# Altium schematic sheet IMU_breakout.SchDoc
size B
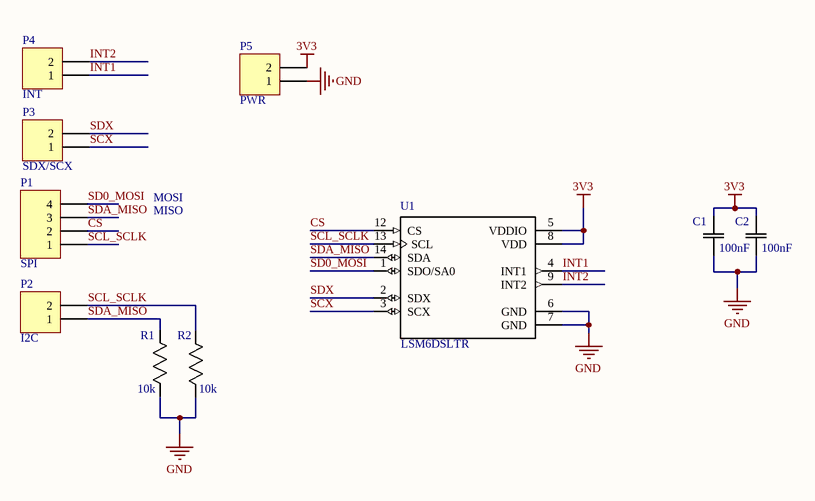
[diagram p0: IMU_breakout.SchDoc]

## Parts
C1  100nF  [0805]
C2  100nF  [0805]
P1  SPI  [HDR1X4]
P2  I2C  [HDR1X2]
P3  SDX/SCX  [HDR1X2]
P4  INT  [HDR1X2]
P5  PWR  [HDR1X2]
R1  10k  [0805]
R2  10k  [0805]
U1  LSM6DSLTR  [LGA-14]

## Nets
3V3: C1.2(C2) C2.2(C2) P5.2 U1.5(VDDIO) U1.8(VDD)
GND: C1.1(C1) C2.1(C1) P5.1 R1.2(R2) R2.2(R2) U1.6(GND) U1.7(GND)
CS: P1.2 U1.12(CS)
INT1: P4.1 U1.4(INT1)
INT2: P4.2 U1.9(INT2)
SCL_SCLK: P1.1 P2.2 R2.1(R1) U1.13(SCL)
SCX: P3.1 U1.3(SCX)
SD0_MOSI: P1.4 U1.1(SDO/SA0)
SDA_MISO: P1.3 P2.1 R1.1(R1) U1.14(SDA)
SDX: P3.2 U1.2(SDX)

## Notes on the sheet
- MOSI
- MISO

## Library data of the parts
C1 C2 = CAP 100nF 0805: CAP CER 0.1UF 50V X7R 0805; MP: CC0805KRX7R9BB104; MF: Yageo; Tolerance: 10%; Package: 0805; Price: 0,119 CAD; Value: 100nF; Digikey: 311-1140-1-ND; Digikey Link: https://www.digikey.ca/products/en?keywords=311-1140-1-ND; Rating: 50V
P1 = Header 4: Header, 4-Pin; LatestRevisionDate: 17-Jul-2002; LatestRevisionNote: Re-released for DXP Platform.; Publisher: Altium Limited
P2-P5 = Header 2: Header, 2-Pin; LatestRevisionDate: 17-Jul-2002; LatestRevisionNote: Re-released for DXP Platform.; Publisher: Altium Limited
R1 R2 = RES 10k 0805: RES SMD 10K OHM 1% 1/8W 0805; MP: RC0805FR-0710KL; MF: Yageo; Rating: 0.125W; Digikey: 311-10.0KCRCT-ND; Price: 0.061 CAD; Package: 0805; Value: 10k; Digikey Link: https://www.digikey.ca/products/en?keywords=311-10.0KCRCT-ND; Tolerance: 1%
U1 = LSM6DSLTR: Accelerometer, Gyroscope, Temperature, 6 Axis Sensor IÂ²C, SPI Output; MF: STMicroelectronics; SnapEDA_Link: https://www.snapeda.com/parts/LSM6DSLTR/STMicroelectronics/view-part/550517/?ref=snap; Price: None; Availability: Unavailable; MP: LSM6DSLTR; Package: LGA-14 STMicroelectronics; Value: *